# Altium schematic sheet MCU.SchDoc
size A3; SheetNumber: 2; SheetTotal: 5
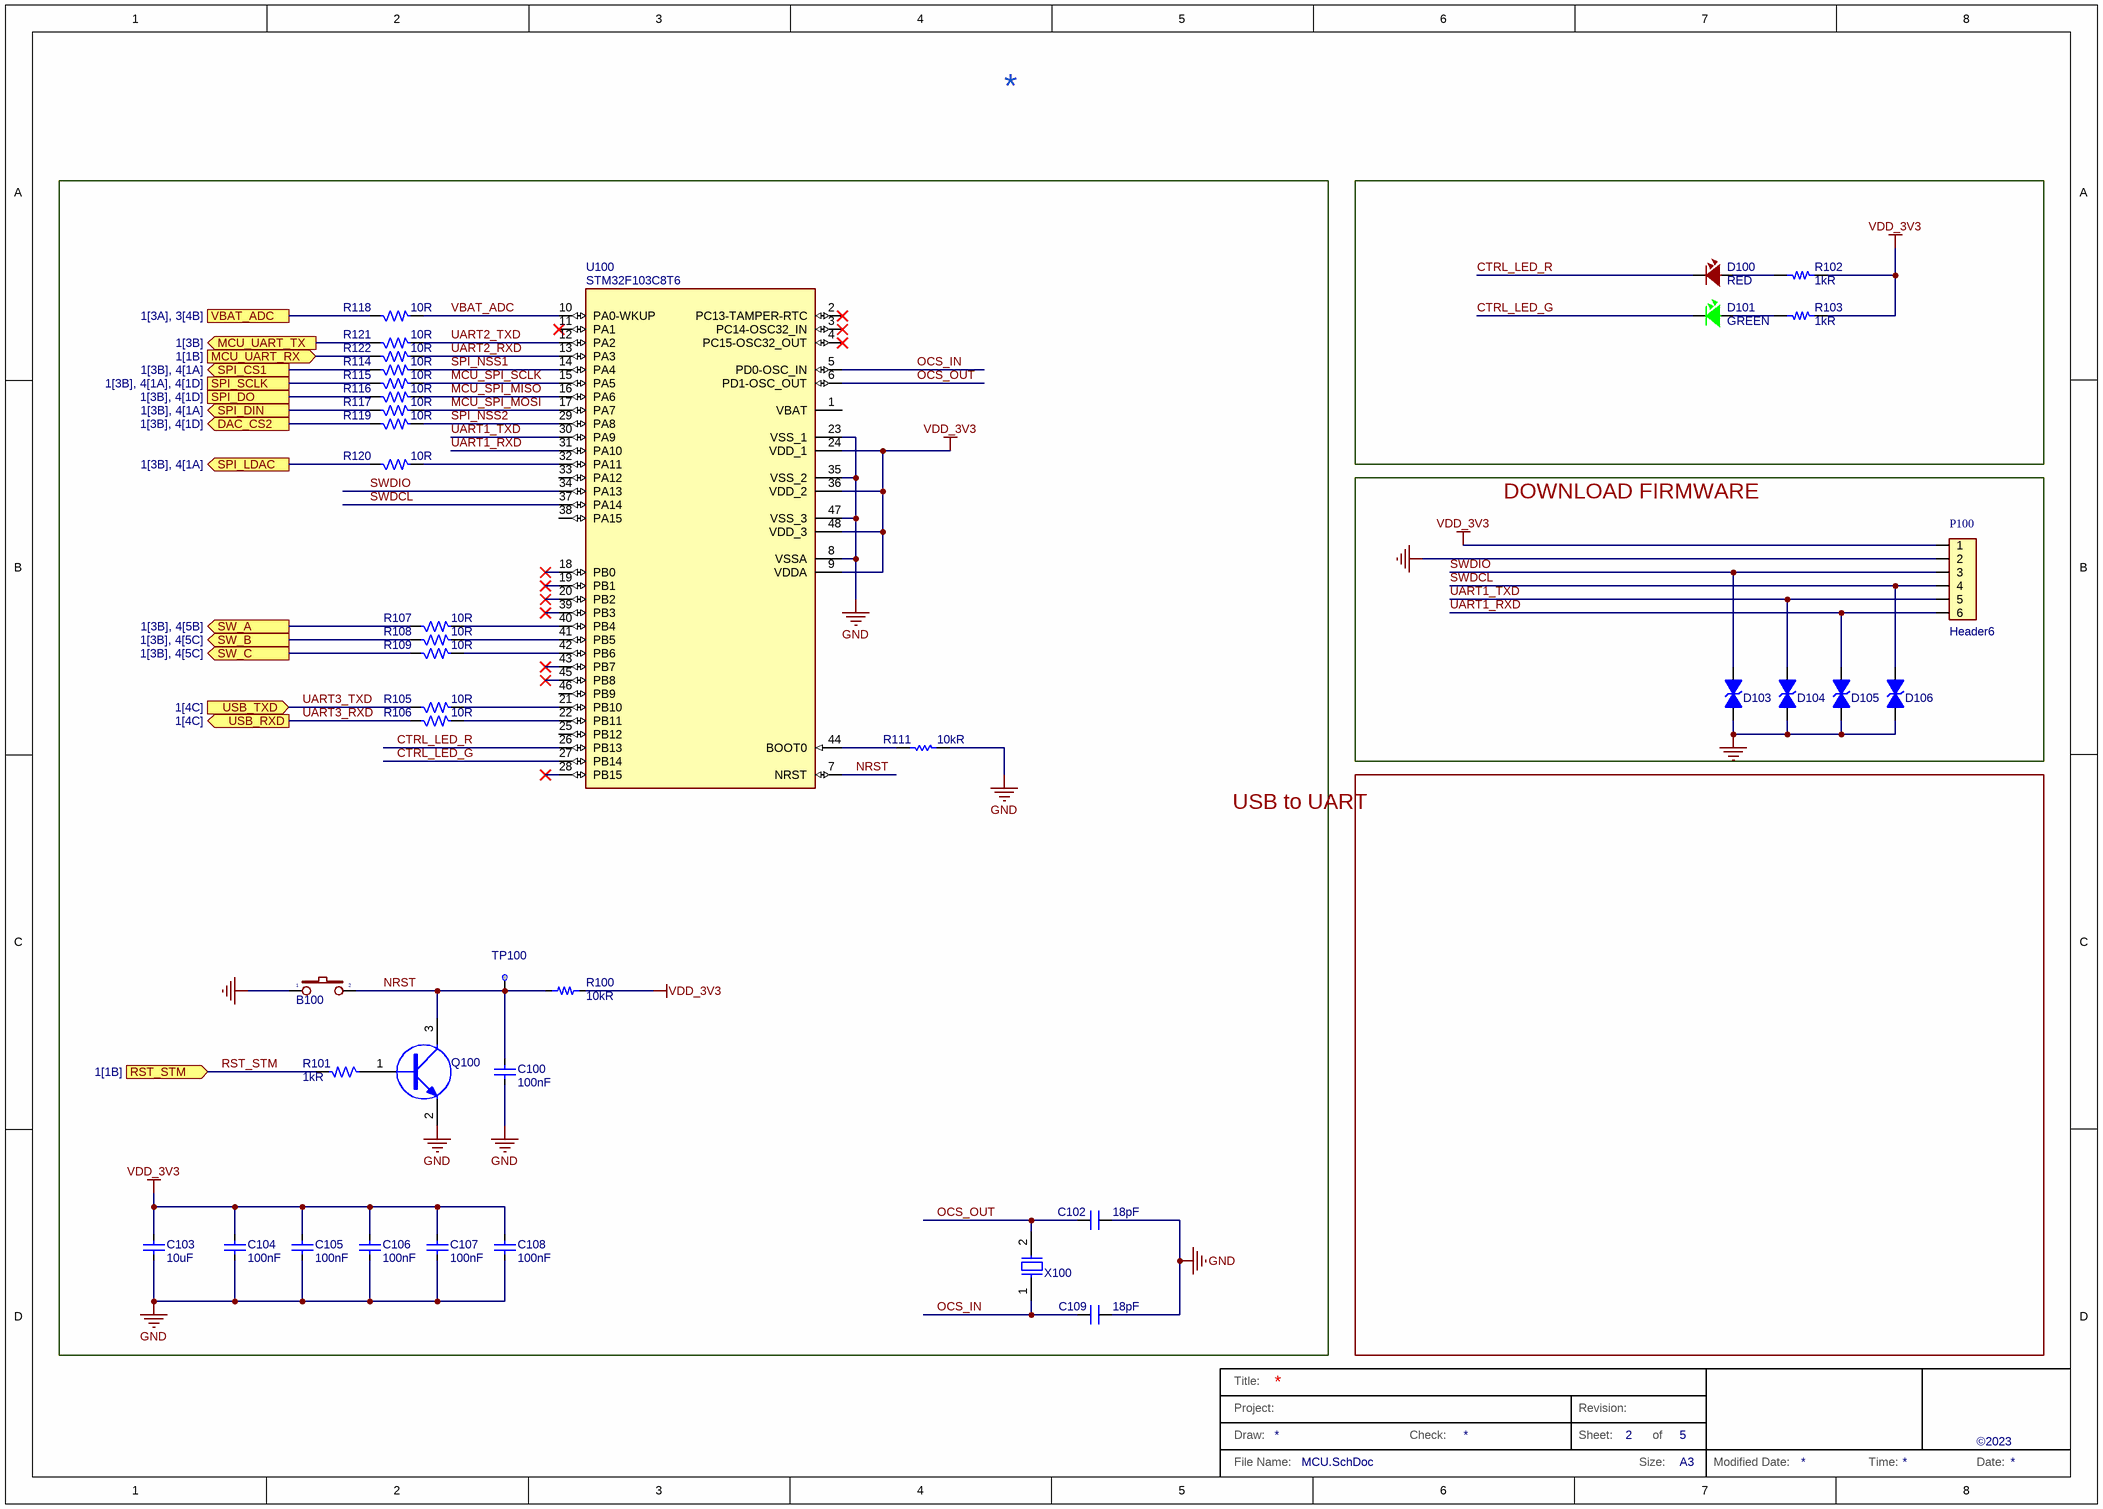
[diagram p0: MCU.SchDoc]

## Parts
B100  Button 3x4x2.5  [BUTTON_2P_SMD]  (value not drawn)
C100  100nF  [CAP0603-M]
C102  18pF  [CAP0603-M]
C103  10uF  [CAP0603-M]
C104  100nF  [CAP0603-M]
C105  100nF  [CAP0603-M]
C106  100nF  [CAP0603-M]
C107  100nF  [CAP0603-M]
C108  100nF  [CAP0603-M]
C109  18pF  [CAP0603-M]
D100  RED  [LED-0603-Red]
D101  GREEN  [LED-0603-Green]
D103  ESDAXLC6-1BU2  [2-UDFN]  (value not drawn)
D104  ESDAXLC6-1BU2  [2-UDFN]  (value not drawn)
D105  ESDAXLC6-1BU2  [2-UDFN]  (value not drawn)
D106  ESDAXLC6-1BU2  [2-UDFN]  (value not drawn)
P100  Header6  [XH2.54 2x3]
Q100  MMBT4401  [SOT23-3]  (value not drawn)
R100  10kR  [R_0603]
R101  1kR  [R_0603]
R102  1kR  [R_0603]
R103  1kR  [R_0603]
R105  10R  [R_0603]
R106  10R  [R_0603]
R107  10R  [R_0603]
R108  10R  [R_0603]
R109  10R  [R_0603]
R111  10kR  [R_0603]
R114  10R  [R_0603]
R115  10R  [R_0603]
R116  10R  [R_0603]
R117  10R  [R_0603]
R118  10R  [R_0603]
R119  10R  [R_0603]
R120  10R  [R_0603]
R121  10R  [R_0603]
R122  10R  [R_0603]
TP100  RST  [TPH]  (value not drawn)  (no BOM)
U100  STM32F103C8T6  [LQFP48]
X100  WTL5G60391VH  [XTAL_SMD_3P5]  (value not drawn)

## Blocks framed on the sheet
DOWNLOAD FIRMWARE: D103-D106 P100

## Ports
DAC_CS2 (out, see 1[3B], 4[1D]), MCU_UART_RX (in, see 1[1B]), MCU_UART_TX (out, see 1[3B]), RST_STM (in, see 1[1B]), SPI_CS1 (out, see 1[3B], 4[1A]), SPI_DIN (out, see 1[3B], 4[1A]), SPI_DO (see 1[3B], 4[1D]), SPI_LDAC (out, see 1[3B], 4[1A]), SPI_SCLK (see 1[3B], 4[1A], 4[1D]), SW_A (out, see 1[3B], 4[5B]), SW_B (out, see 1[3B], 4[5C]), SW_C (out, see 1[3B], 4[5C]), USB_RXD (out, see 1[4C]), USB_TXD (in, see 1[4C]), VBAT_ADC (see 1[3A], 3[4B])

## Nets
GND: B100.1 C100.1 C102.1 C103.1 C104.1 C105.1 C106.1 C107.1 C108.1 C109.1 D103.2(K) D104.2(K) D105.2(K) D106.2(K) P100.2 Q100.2(E) R111.2 U100.8(VSSA) U100.23(VSS_1) U100.35(VSS_2) U100.47(VSS_3)
VDD_3V3: C103.2 C104.2 C105.2 C106.2 C107.2 C108.2 P100.1 R100.1 R102.2 R103.2 U100.9(VDDA) U100.24(VDD_1) U100.36(VDD_2) U100.48(VDD_3)
CTRL_LED_G: D101.2 U100.27(PB14)
CTRL_LED_R: D100.2 U100.26(PB13)
DAC_CS2: R119.1 ; port DAC_CS2
MCU_SPI_MISO: R116.2 U100.16(PA6)
MCU_SPI_MOSI: R117.2 U100.17(PA7)
MCU_SPI_SCLK: R115.2 U100.15(PA5)
MCU_UART_RX: R122.1 ; port MCU_UART_RX
MCU_UART_TX: R121.1 ; port MCU_UART_TX
NRST: B100.2 C100.2 Q100.3(C) R100.2 TP100.1(TP) U100.7(NRST)
OCS_IN: C109.2 U100.5(PD0-OSC_IN) X100.1
OCS_OUT: C102.2 U100.6(PD1-OSC_OUT) X100.2
RST_STM: R101.2 ; port RST_STM
SPI_CS1: R114.1 ; port SPI_CS1
SPI_DIN: R117.1 ; port SPI_DIN
SPI_DO: R116.1 ; port SPI_DO
SPI_LDAC: R120.1 ; port SPI_LDAC
SPI_NSS1: R114.2 U100.14(PA4)
SPI_NSS2: R119.2 U100.29(PA8)
SPI_SCLK: R115.1 ; port SPI_SCLK
SW_A: R107.1 ; port SW_A
SW_B: R108.1 ; port SW_B
SW_C: R109.1 ; port SW_C
SWDCL: D106.1(A) P100.4 U100.37(PA14)
SWDIO: D103.1(A) P100.3 U100.34(PA13)
UART1_RXD: D105.1(A) P100.6 U100.31(PA10)
UART1_TXD: D104.1(A) P100.5 U100.30(PA9)
UART2_RXD: R122.2 U100.13(PA3)
UART2_TXD: R121.2 U100.12(PA2)
UART3_RXD: R106.1 ; port USB_RXD
UART3_TXD: R105.1 ; port USB_TXD
VBAT_ADC: R118.2 U100.10(PA0-WKUP)
VBAT_ADC: R118.1 ; port VBAT_ADC  [a separate net that carries the same name]
NetD100_1: D100.1 R102.1
NetD101_1: D101.1 R103.1
NetQ100_1: Q100.1(B) R101.1
NetR105_2: R105.2 U100.21(PB10)
NetR106_2: R106.2 U100.22(PB11)
NetR107_2: R107.2 U100.40(PB4)
NetR108_2: R108.2 U100.41(PB5)
NetR109_2: R109.2 U100.42(PB6)
NetR111_1: R111.1 U100.44(BOOT0)
NetR120_2: R120.2 U100.32(PA11)

Not connected (* = marked no-connect by the designer): U100 1(VBAT) 2(PC13-TAMPER-RTC)* 3(PC14-OSC32_IN)* 4(PC15-OSC32_OUT)* 11(PA1)* 18(PB0)* 19(PB1)* 20(PB2)* 25(PB12) 28(PB15)* 33(PA12) 38(PA15) 39(PB3)* 43(PB7)* 45(PB8)* 46(PB9)

## Notes on the sheet
- USB to UART
- Title:
- Project:
- Draw:
- Check:
- Revision:
- Sheet:
- of
- ©2023
- File Name:
- Size:
- A3
- Modified Date:
- Time:
- Date:

## Library data of the parts
C100 C104-C108 = CapSMD: CAP CER 100nF 16V X5R 0603
C102 C109 = Cap_Cer_0603_18pF: CAP CER 18PF 50V C0G/NP0 0603; Manufacturer: Murata Electronics
C103 = CapSMD: CAP CER 10UF 16V X5R 0603
D100 = LED_3: LED RED
D101 = LED_1: LED GREEN
D103-D106 = ESDAXLC6-1BU2: TVS DIODE 3VWM 17VC ST0201; Manufacturer: STMicroelectronics; Capacitance: 0.5pF; Manufacturer Part Number 1: ESDAXLC6-1BU2; Manufacturer 1: STMicroelectronics; Manufacturer Part Number: ESDAXLC6-1BU2
P100 = Header6: Manufacturer: W¨¹rth Elektronik eiSos GmbH
Q100 = NPN: Transistor C1815, SOT23; Manufacturer: Fairchild Semiconductor
R100 = Resistor - SMD: RES SMD 10K OHM 1% 1/8W 0603; Manufacturer: Generic Components
R101 = R: RES SMD 1K OHM 1% 1/8W 0603; Manufacturer: Yageo
R102 R103 = Resistor - SMD: RES SMD 1K OHM 1% 1/8W 0603; Manufacturer: Generic Components
R105-R109 R114-R122 = R: RES SMD 10R OHM 1% 1/8W 0603; Manufacturer: Yageo
R111 = RES_10K_0201: RES SMD 10K OHM 1% 1/8W 0603; Manufacturer 1: Yageo; Manufacturer Part Number 1: RC0201FR-0711K3L; Revision: 1; Manufacturer 2: Panasonic Electronic Components
TP100 = S1400-000002: Test_Point_1mm; Footprint: TP_1mm
U100 = STM32F103C8T6: IC MCU 48LQFP; Manufacturer: STMicroelectronics; Manufacturer Part Number 1: STM32F103C8T6
X100 = Xtal_2P_SMD_5P0X3P5_8Mhz: XTal 8Mhz; Manufacturer: WTL; Manufacturer Part Number 1: WTL5G60391VH